# Altium schematic sheet TS3USB221A_PINOUT.SchDoc
size A4; SheetNumber: 16; SheetTotal: 17
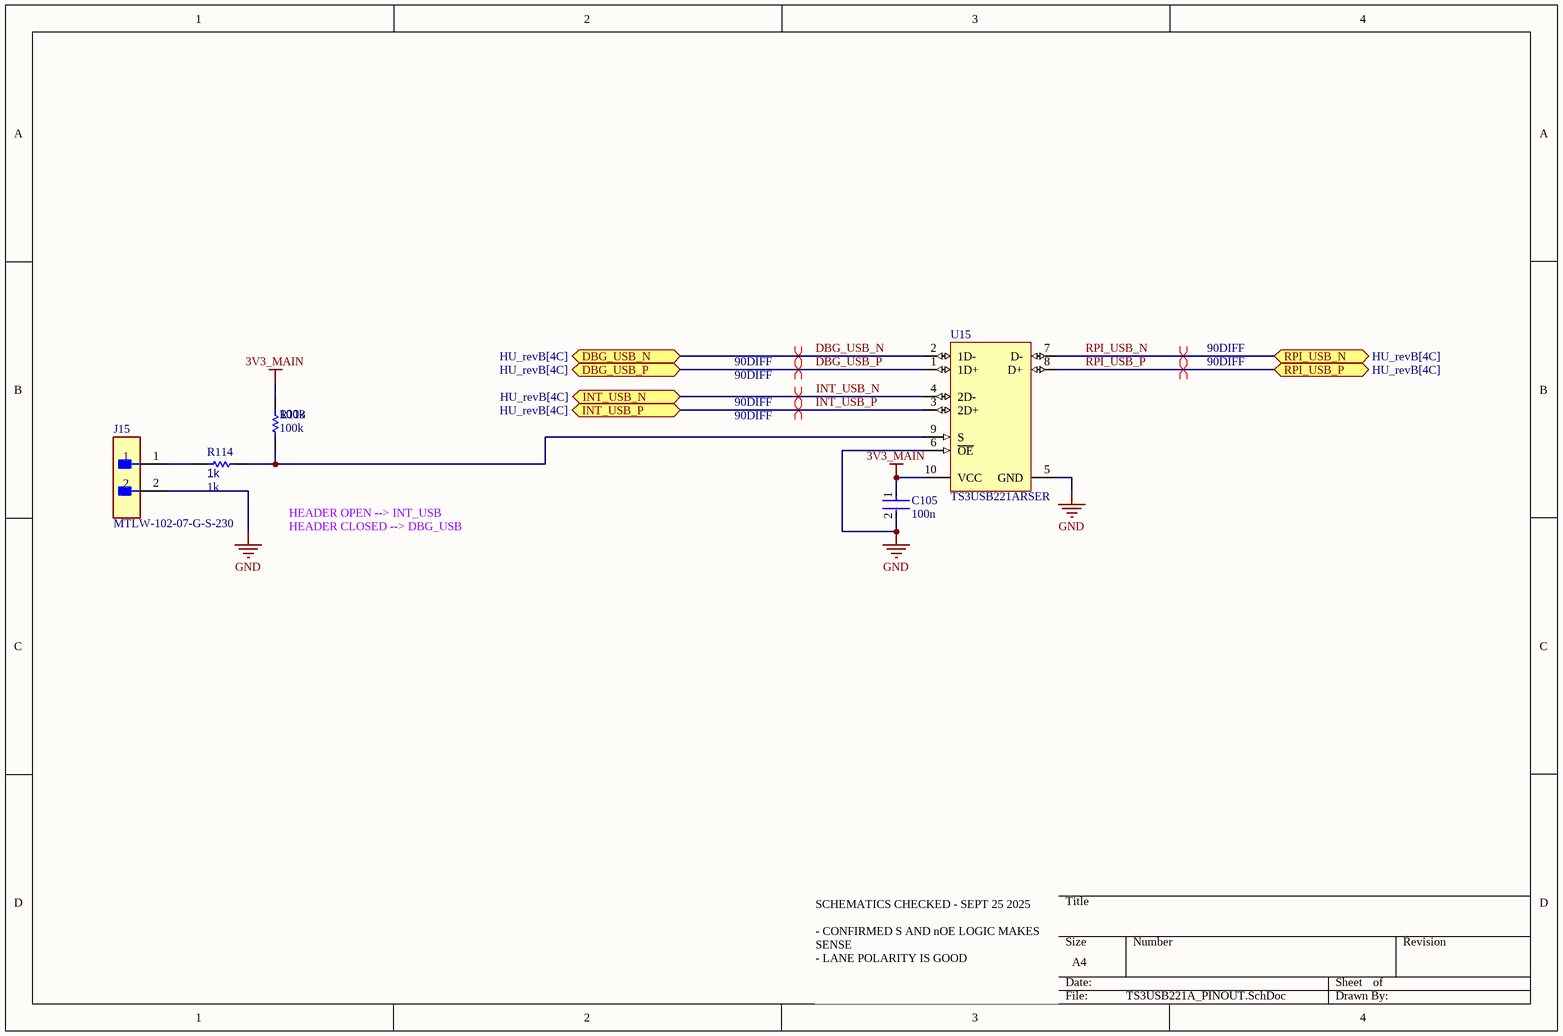
[diagram p0: TS3USB221A_PINOUT.SchDoc]

## Parts
C105  100n  [FP-0402-L_1_0_0_05-W_0_5-IPC_A]
J15  MTLW-102-07-G-S-230  [FP-MTLW-102-07-G-S-230-MFG]
R113  100k  [R0603B]
R114  1k  [R0603B]
U15  TS3USB221ARSER  [RSE0010A_V]

## Ports
DBG_USB_N (bidir, see HU_revB[4C]), DBG_USB_P (bidir, see HU_revB[4C]), INT_USB_N (bidir, see HU_revB[4C]), INT_USB_P (bidir, see HU_revB[4C]), RPI_USB_N (bidir, see HU_revB[4C]), RPI_USB_P (bidir, see HU_revB[4C])

## Nets
3V3_MAIN: C105.1 R113.2 U15.10(VCC)
GND: C105.2 J15.2 U15.5(GND) U15.6(~{OE})
DBG_USB_N: U15.2(1D-) ; port DBG_USB_N
DBG_USB_P: U15.1(1D+) ; port DBG_USB_P
INT_USB_N: U15.4(2D-) ; port INT_USB_N
INT_USB_P: U15.3(2D+) ; port INT_USB_P
RPI_USB_N: U15.7(D-) ; port RPI_USB_N
RPI_USB_P: U15.8(D+) ; port RPI_USB_P
NetJ15_1: J15.1 R114.2
NetR113_1: R113.1 R114.1 U15.9(S)

## Layout directives
differential pair; differential pair class 90DIFF: DBG_USB_N, DBG_USB_P, INT_USB_N, INT_USB_P, RPI_USB_N, RPI_USB_P

## Notes on the sheet
- HEADER OPEN --> INT_USB
  HEADER CLOSED --> DBG_USB
- SCHEMATICS CHECKED - SEPT 25 2025
  - CONFIRMED S AND nOE LOGIC MAKES SENSE
  - LANE POLARITY IS GOOD

## Library data of the parts
C105 = CMP-001-00058-1: LARGE PADS, 0402 CAP, CHANGE COMMENT TO MATCH REAL P/N; Capacitor Type: Ceramic; Min Operating Temperature: -55°C; Mounting Technology: Surface Mount; Pins: 2; Case/Package: 0402; RoHS Compliant: Yes; Max Operating Temperature: 85°C
J15 = CMP-02766-001053-1: CONN HEADER VERT 2POS 2.54MM; Max Current Rating: 3A; Number of Contacts: 2; Gender: Male; Housing Color: Black; Housing Material: Polymer; Radiation Hardening: No; Min Operating Temperature: -55°C; Contact Plating: Gold; Termination: Solder; Number of Rows: 1; Max Operating Temperature: 125°C; Contact Material: Bronze; Pitch: 2.54mm; Depth: 2.48mm; Length: 5.08mm; Orientation: Straight; Packaging: Bulk
R113 R114 = CMP-009-00002-14: Resistor
  R113: Value: 100k
  R114: Value: 1k
U15 = CMP-0309-00017-2: ESD Protected,High-Speed USB 2.0 (480-Mbps) 1:2 Multiplexer / Demultiplexer Switch, 1:2 Mux / Demux, 6 ohm RON, 2.5 to 3.3V, -40 to 85 degC, 10-Pin UQFN (RSE), Green (RoHS & no Sb/Br); Manufacturer: Texas Instruments; tpd max(ns): 0.25; RON Mis-match(Max)(Ohms): 0.2; OFF Time(Max)(ns): 12; Architecture: "1","2 mux/demux"; IL OFF(Max)(nA): 2; SubFamily: USB Switch; ESD HBM(kV): +/-7; ron(max)(ohms): 6; ON Time(Max)(ns): 30; Bandwidth(MHz): 900; RON Flatness(Max)(Ohms): 1; Vcc range(V): 2.3 to 3.6; Mounting Technology: Surface Mount; ComponentLink2URL: http://www.ti.com/lit/ml/mpqf186c/mpqf186c.pdf; PackageDescription: 10-Leads Plastic Quad Flatpack No-Lead, 2 x 1.5 x 0.55 mm Body, 0.5 mm Pitch; ComponentLink1URL: http://www.ti.com/general/docs/lit/getliterature.tsp?genericPartNumber=TS3USB221A&fileType=pdf; PackageReference: RSE0010A; ComponentLink2Description: Package Specification; PartNumber: TS3USB221ARSER; Code_JEDEC: MO-288-UEFD; DatasheetVersion: SCDS277; ComponentLink1Description: Datasheet; Eco-Plan: Green (RoHS & no Sb/Br); Number of Channels: 2; PackageVersion: revD, Jan-2011; ICC(uA): 30